# Altium schematic sheet USB_TO_UART.SchDoc
size A; SheetNumber: 4; SheetTotal: 5
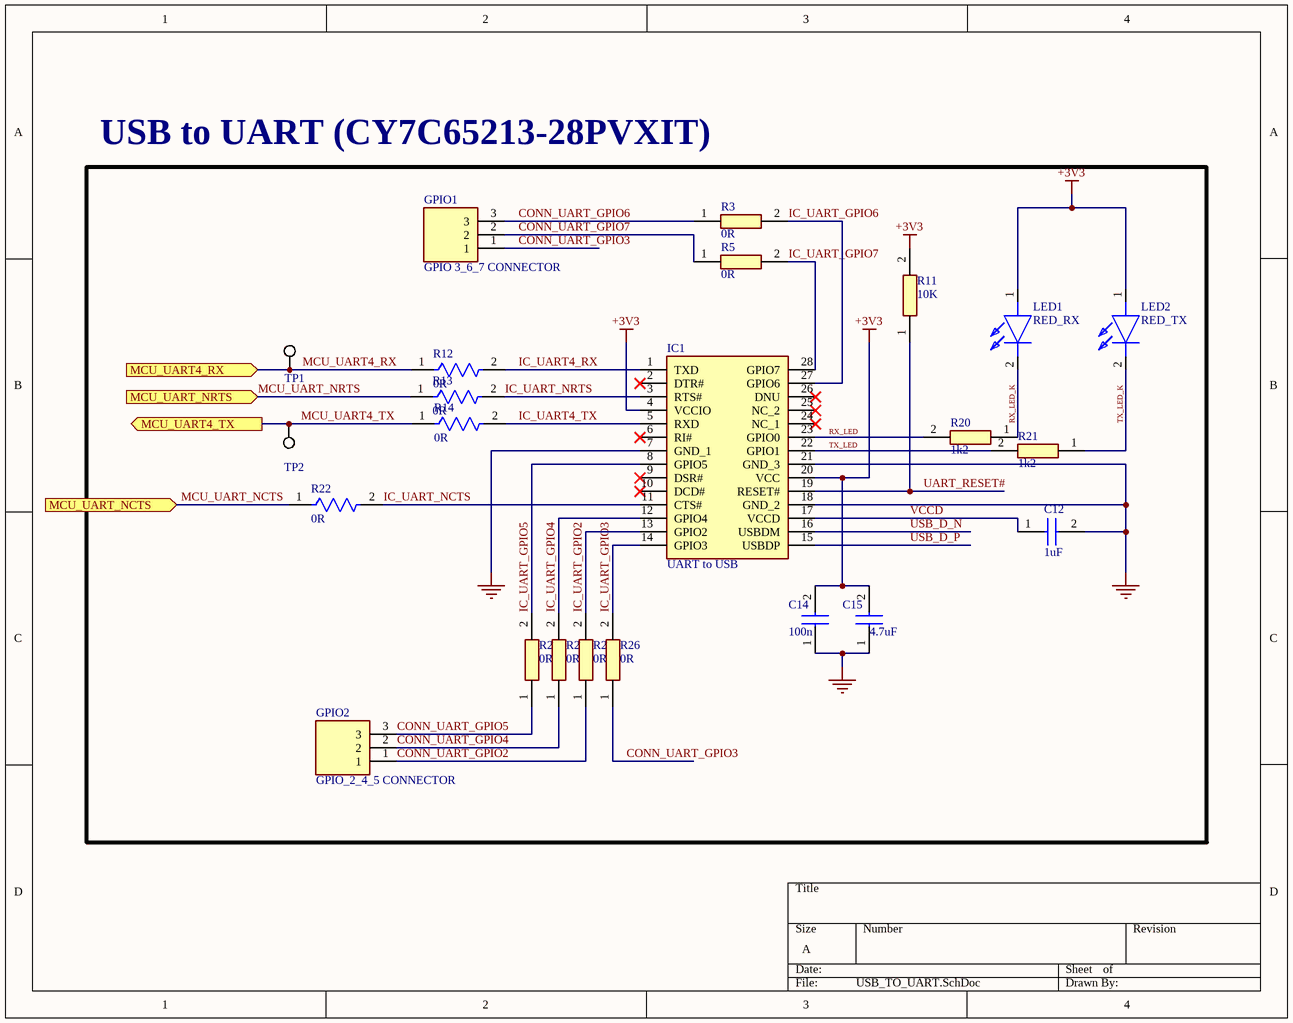
[diagram p0: USB_TO_UART.SchDoc]

## Parts
C12  1uF  [CAPC1608X90N]
C14  100n  [CAPC1608X95N]
C15  4.7uF  [CAPC1608X95N]
GPIO1  GPIO 3_6_7 CONNECTOR  [HDRV3W64P0X254_1X3_762X254X864P]
GPIO2  GPIO_2_4_5 CONNECTOR  [HDRV3W64P0X254_1X3_762X254X864P]
IC1  UART to USB  [SOP65P780X200-28N]
LED1  RED_RX  [APT2012SECKJ3PRV]
LED2  RED_TX  [APT2012SECKJ3PRV]
R3  0R  [RESC1608X55N]
R5  0R  [RESC1608X55N]
R11  10K  [RESC1608X55N]
R12  0R  [FP-ERJ-3GEY0R00V-MFG]
R13  0R  [FP-ERJ-3GEY0R00V-MFG]
R14  0R  [FP-ERJ-3GEY0R00V-MFG]
R20  1k2  [RESC1608X55N]
R21  1k2  [RESC1608X55N]
R22  0R  [FP-ERJ-3GEY0R00V-MFG]
R23  0R  [RESC1608X55N]
R24  0R  [RESC1608X55N]
R25  0R  [RESC1608X55N]
R26  0R  [RESC1608X55N]
TP1  5019  [KSTN-5019_V]  (value not drawn)
TP2  5019  [KSTN-5019_V]  (value not drawn)

## Blocks framed on the sheet
USB to UART (CY7C65213-28PVXIT): C12 C14 C15 GPIO1 GPIO2 IC1 LED1 LED2 R3 R5 R11-R14 R20-R26 TP1 TP2

## Ports
MCU_UART4_RX (in), MCU_UART4_TX (out), MCU_UART_NCTS (in), MCU_UART_NRTS (in)

## Nets
+3V3: C14.2 C15.2 IC1.4(VCCIO) IC1.20(VCC) LED1.1(A) LED2.1(A) R11.2
GND: C12.2 C14.1 C15.1 IC1.7(GND_1) IC1.18(GND_2) IC1.21(GND_3)
CONN_UART_GPIO2: GPIO2.1 R25.1
CONN_UART_GPIO3: GPIO1.1 R26.1
CONN_UART_GPIO4: GPIO2.2 R24.1
CONN_UART_GPIO5: GPIO2.3 R23.1
CONN_UART_GPIO6: GPIO1.3 R3.1
CONN_UART_GPIO7: GPIO1.2 R5.1
IC_UART4_RX: IC1.1(TXD) R12.2
IC_UART4_TX: IC1.5(RXD) R14.2
IC_UART_GPIO2: IC1.13(GPIO2) R25.2
IC_UART_GPIO3: IC1.14(GPIO3) R26.2
IC_UART_GPIO4: IC1.12(GPIO4) R24.2
IC_UART_GPIO5: IC1.8(GPIO5) R23.2
IC_UART_GPIO6: IC1.27(GPIO6) R3.2
IC_UART_GPIO7: IC1.28(GPIO7) R5.2
IC_UART_NCTS: IC1.11(CTS#) R22.2
IC_UART_NRTS: IC1.3(RTS#) R13.2
MCU_UART4_RX: R12.1 TP1.1 ; port MCU_UART4_RX
MCU_UART4_TX: R14.1 TP2.1 ; port MCU_UART4_TX
MCU_UART_NCTS: R22.1 ; port MCU_UART_NCTS
MCU_UART_NRTS: R13.1 ; port MCU_UART_NRTS
RX_LED: IC1.23(GPIO0) R20.2
RX_LED_K: LED1.2(K) R20.1
TX_LED: IC1.22(GPIO1) R21.2
TX_LED_K: LED2.2(K) R21.1
UART_RESET#: IC1.19(RESET#) R11.1
USB_D_N: IC1.16(USBDM)
USB_D_P: IC1.15(USBDP)
VCCD: C12.1 IC1.17(VCCD)

Not connected (* = marked no-connect by the designer): IC1 2(DTR#)* 6(RI#)* 9(DSR#)* 10(DCD#)* 24(NC_1)* 25(NC_2)* 26(DNU)*

## Library data of the parts
C12 = CL10A105KA8NFNC: Capacitor; Manufacturer_Name: SAMSUNG; Datasheet Link: https://www.mouser.co.za/datasheet/2/585/MLCC-1837944.pdf; Height: 0.9mm; Manufacturer_Part_Number: CL10A105KA8NFNC; Mouser Part Number: 187-CL10A105KA8NFNC; Mouser Price/Stock: https://www.mouser.co.uk/ProductDetail/Samsung-Electro-Mechanics/CL10A105KA8NFNC?qs=%252B6g0mu59x7ItvV%2F7DV9Lig%3D%3D; Arrow Part Number: CL10A105KA8NFNC; Arrow Price/Stock: https://www.arrow.com/en/products/cl10a105ka8nfnc/samsung-electro-mechanics?region=nac
C14 C15 = C0603C104J4RAC: Capacitor; Manufacturer_Name: KEMET; Datasheet Link: https://datasheet.datasheetarchive.com/originals/distributors/SFDatasheet-4/sf-00083930.pdf; Height: 0.95mm; Manufacturer_Part_Number: C0603C104J4RAC; Mouser Part Number: 80-C0603C104J4RAC; Mouser Price/Stock: https://www.mouser.co.uk/ProductDetail/KEMET/C0603C104J4RAC?qs=sykUljcfnH31MXmq5HGjkg%3D%3D; Arrow Part Number: C0603C104J4RAC; Arrow Price/Stock: https://www.arrow.com/en/products/c0603c104j4rac/kemet-corporation?region=nac
GPIO1 GPIO2 = M20-9990345: Connector; Manufacturer_Name: Harwin; Datasheet Link: https://cdn.harwin.com/pdfs/M20-999.pdf; Height: 8.64mm; Manufacturer_Part_Number: M20-9990345; Mouser Part Number: 855-M20-9990345; Mouser Price/Stock: https://www.mouser.co.uk/ProductDetail/Harwin/M20-9990345?qs=ulE8k0yEMYbl6ZPCtNdmpA%3D%3D
IC1 = CY7C65213-28PVXIT: Integrated Circuit; Manufacturer_Name: Infineon; Datasheet Link: https://componentsearchengine.com/Datasheets/2/CY7C65213-28PVXIT.pdf; Height: 2mm; Manufacturer_Part_Number: CY7C65213-28PVXIT; Mouser Part Number: 727-CY7C6521328PVXIT; Mouser Price/Stock: https://www.mouser.co.uk/ProductDetail/Infineon-Technologies/CY7C65213-28PVXIT?qs=cwEsOGdHuFTfRgwUJVDa5g%3D%3D; Arrow Part Number: CY7C65213-28PVXIT; Arrow Price/Stock: https://www.arrow.com/en/products/cy7c65213-28pvxit/infineon-technologies-ag?region=nac
LED1 LED2 = APT2012SECK_J3-PRV: LED; Manufacturer_Name: Kingbright; Manufacturer_Part_Number: APT2012SECK/J3-PRV; Datasheet Link: https://www.mouser.de/datasheet/2/216/APT2012SECK-J3-PRV-1173389.pdf; Height: 0.85mm; Mouser Part Number: 604-APT2012SECKJ3PRV; Mouser Price/Stock: https://www.mouser.co.uk/ProductDetail/Kingbright/APT2012SECK-J3-PRV?qs=D2TOvUWgdJ6T9J6WfI%252BQOg%3D%3D; Arrow Part Number: APT2012SECK/J3-PRV; Arrow Price/Stock: https://www.arrow.com/en/products/apt2012seckj3-prv/kingbright?region=nac
R3 R5 R11 R20 R21 R23-R26 = RK73B1JTTD103J: Resistor; Manufacturer_Name: KOA Speer; Datasheet Link: http://www.koaspeer.com/catimages/Products/RK73-RT/RK73-RT.pdf; Height: 0.55mm; Manufacturer_Part_Number: RK73B1JTTD103J; Mouser Part Number: 660-RK73B1JTTD103J; Mouser Price/Stock: https://www.mouser.co.uk/ProductDetail/KOA-Speer/RK73B1JTTD103J?qs=hmtrJ2UjXcBKRTcwO9LloQ%3D%3D; Arrow Part Number: RK73B1JTTD103J; Arrow Price/Stock: https://www.arrow.com/en/products/rk73b1jttd103j/koa-speer-electronics?region=asia
R12-R14 R22 = CMP-2000-00700-2: RES SMD 0 OHM JUMPER 1/10W 0603; Manufacturer Part Number: ERJ-3GEY0R00V; Manufacturer: Panasonic; Tolerance: 5%; Automotive Grade: Grade 0; Voltage Rating: 75V; Value: 0Ω; Temperature Coefficient: -100/+600ppm/°C; Power Rating: 0.1W; Mouser Description: Resistor, Chip Thick Film, 0 Ohm, 0.1w, Resistor, Chip Thick Film, 0 Ohm, 0.1w, 5%; Ipc Land Pattern Name: RESC16080X45; Category: Res; Package: 0603; Temperature: -55°C to +155°C; Temperature Range Low: -55°C; Series: ERJ; Resistance: 0Ω; RoHS: TRUE; Composition: Thick Film; Octopart: https://octopart.com/erj-3gey0r00v-panasonic-55389238; Device Class L1: Passive Components; Footprint Url: https://industrial.panasonic.com/cdbs/www-data/pdf/RDA0000/DMA0000COL17.pdf; ComponentLink2Description: Datasheet; Device Class L2: Resistors; Temperature Range High: +155°C; Digikey Description: RES SMD 0 OHM JUMPER 1/10W 0603; Lead Free: Yes; Device Class L3: Chip SMD Resistors; Height: 0.55mm; ComponentLink2URL: https://industrial.panasonic.com/cdbs/www-data/pdf/RDA0000/AOA0000C301.pdf; Automotive: Yes
TP1 TP2 = CMP-1672-00008-1: Test Point, 1 Position SMD, RoHS, Tape and Reel; ComponentLink1Description: Manufacturer URL; Package Quantity: 1000; DatasheetVersion: 03/2014; Packaging: Tape and Reel; ComponentLink2URL: http://www.keyelco.com/product-pdf.cfm?p=1357; ComponentLink1URL: http://www.keyelco.com/; Mount: Surface Mount; Contact Plating: Silver; PackageDescription: 1-Pin Surface Mount Device, Body 3.81 x 2.03 mm; Pins: 1; RoHSCompliant: True; Mounting Technology: Surface Mount; ComponentLink2Description: Datasheet; PackageReference: 5019